# EAGLE design PowerSupply (EAGLE 7.3.0)
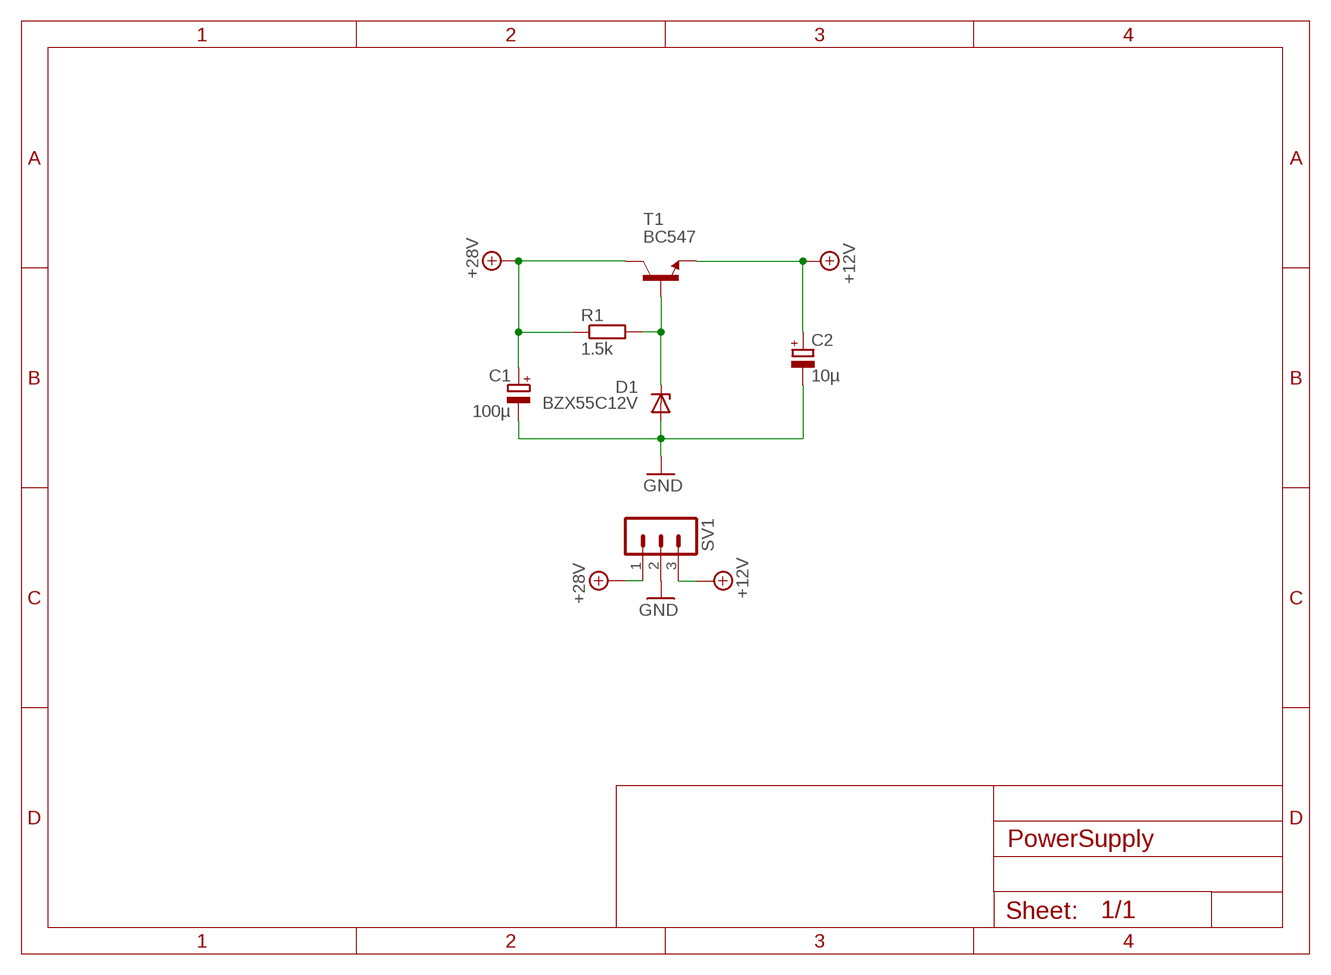
[diagram p0: schematic, sheet 1]

## Parts
C1  100µ  CPOL-EUE5-10.5  [E5-10,5]
C2  10µ  CPOL-EUE5-8.5  [E5-8,5]
D1  BZX55C12V  BZX55  [DO35Z10]
R1  1.5k  R-EU_0309/12  [0309/12]
SV1  MA03-1  [MA03-1]
T1  BC547  [TO92]

## Nets
+12V: C2.+ SV1.3 T1.1(E)
+28V: C1.+ R1.1 SV1.1 T1.3(C)
GND: C1.- C2.- D1.A SV1.2
N$1: D1.C R1.2 T1.2(B)

## Library data of the parts
C1 C2 = rcl:CPOL-EU: POLARIZED CAPACITOR, European symbol
D1 = diode:BZX55: Z DIODE
R1 = rcl:R-EU_: RESISTOR, European symbol
SV1 = con-lstb:MA03-1: PIN HEADER; OC_FARNELL: unknown; OC_NEWARK: unknown
T1 = transistor:BC547: NPN TRANSISTOR

## Board
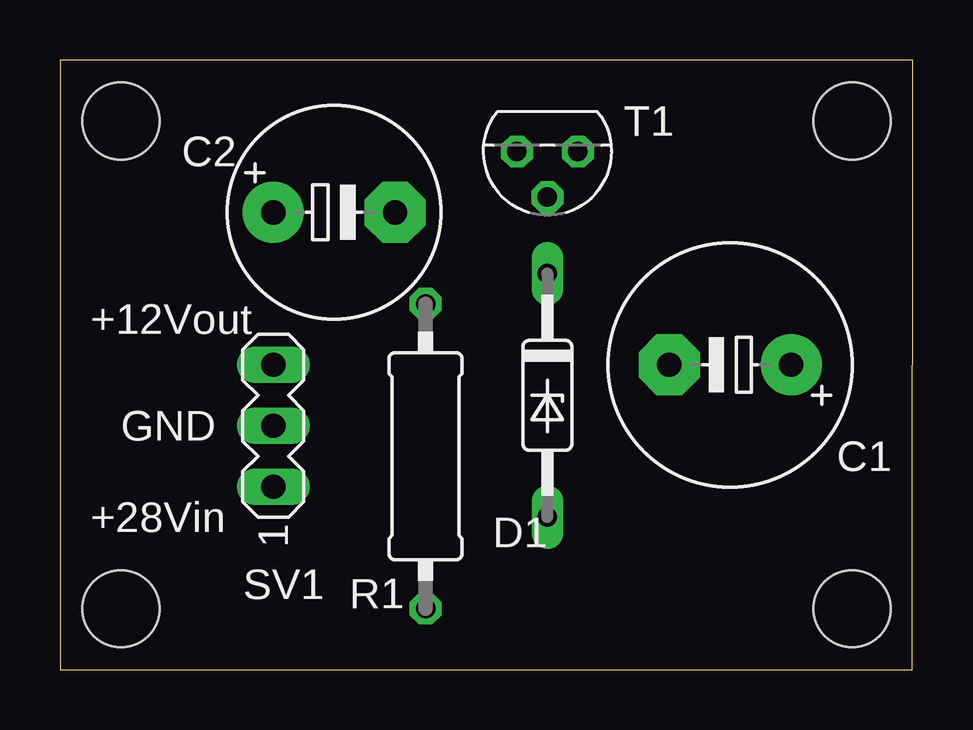
[diagram p1: board, top side]
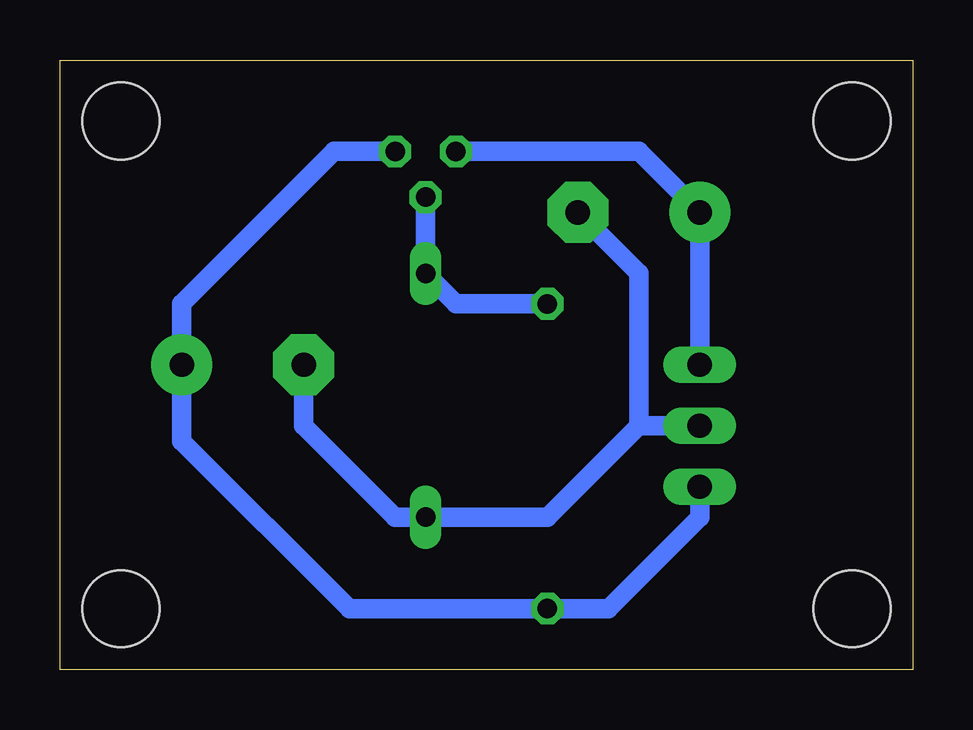
[diagram p2: board, bottom side, seen from below]

Size 35.56 x 25.4 mm. Coordinates in mm from the lower left corner, seen from the top.
Outline: 0,0 35.54,0 35.56,25.4 0,25.4 0,0
Copper layers (1*16): Top 0.035mm / dielectric 1.5mm / Bottom 0.035mm
Design rules "default": minimum track width 10mil, minimum drill 24mil, track to track 8mil, track to pad 8mil, pad to pad 8mil, via to via 8mil, smd to smd 8mil, copper to edge 40mil, drill to drill 8mil, minimum pad ring 10mil, minimum via ring 8mil, stop-mask expansion 4mil, vias tented up to drill 0mil, thermal gap 10mil
Holes 3.2 mm at 2.54,22.86 2.54,2.54 33.02,22.86 33.02,2.54

### Footprints (pad centres in the part's own frame; a part is rotated, then mirrored left to right if it is on the bottom)
E5-10,5 = drill 1.016 pad 2.54: + -2.54,0 | drill 1.016 pad 2.54 octagon: - 2.54,0
E5-8,5 = drill 1.016 pad 2.54: + -2.54,0 | drill 1.016 pad 2.54 octagon: - 2.54,0
DO35Z10 = drill 0.813 long: A 5.08,0; C -5.08,0
0309/12 = drill 0.813 octagon: 1 -6.35,0; 2 6.35,0
MA03-1 = drill 1.016 long: 1 -2.54,0; 2 0,0; 3 2.54,0
TO92 = drill 0.813 octagon: 1 1.27,0; 2 0,1.905; 3 -1.27,0

### Placement (x,y rotation side)
C1  27.94,12.7 180 top
C2  11.43,19.05 0 top
D1  20.32,11.43 270 top
R1  15.24,8.89 90 top
SV1  8.89,10.16 90 top
T1  20.32,21.59 180 top

### Tracks (layer width: path | path; a pad name or v marks a point on that pad's centre or on a via)
+12V
  Bottom 0.813: T1.1 11.43,21.59 C2.+ SV1.3
+28V
  Bottom 0.813: SV1.1 8.89,6.35 12.7,2.54 R1.1 23.5,2.54 30.48,9.53 C1.+ 30.48,15.24 24.13,21.59 T1.3
GND
  Bottom 0.813: SV1.2 11.43,10.16 | 11.43,10.16 15.24,6.35 D1.A 21.59,6.35 25.4,10.16 C1.- | C2.- 11.43,16.51 11.43,10.16
N$1
  Bottom 0.813: R1.2 19.05,15.24 D1.C T1.2

### Text on the board
tPlace: +12Vout | GND | +28Vin